# EAGLE design Keg Cop - Sensors (EAGLE 9.6.2)
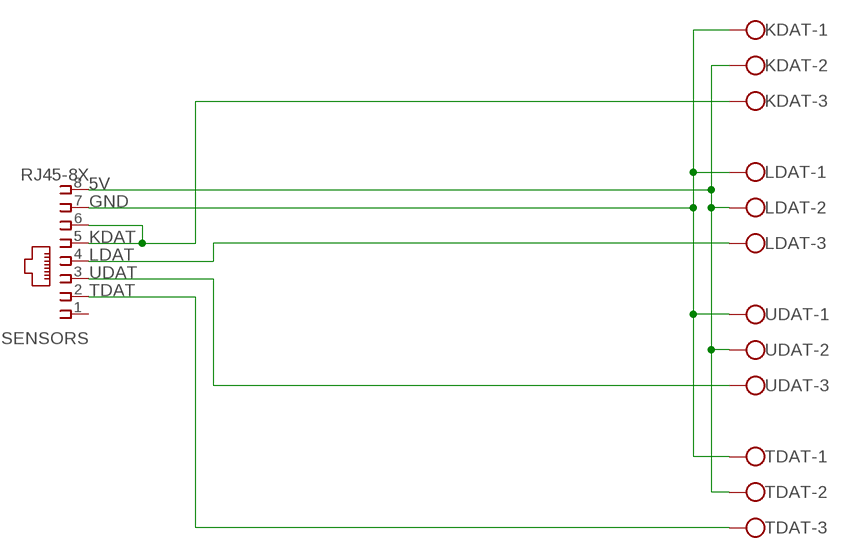
[diagram p0: schematic, sheet 1]

## Parts
KDAT  W237-103  [W237-103]
LDAT  W237-103  [W237-103]
SENSORS  RJ45-8X  [RJ45-NO-SHIELD]
TDAT  W237-103  [W237-103]
UDAT  W237-103  [W237-103]

## Nets
5V: KDAT.2 LDAT.2 SENSORS.8 TDAT.2 UDAT.2
GND: KDAT.1 LDAT.1 SENSORS.7 TDAT.1 UDAT.1
KDAT: KDAT.3 SENSORS.5 SENSORS.6
LDAT: LDAT.3 SENSORS.4
TDAT: SENSORS.2 TDAT.3
UDAT: SENSORS.3 UDAT.3
Unconnected: SENSORS.1

## Library data of the parts
KDAT LDAT TDAT UDAT = con-wago-500:W237-103: WAGO SCREW CLAMP; MPN: 237-103; OC_FARNELL: unknown; OC_NEWARK: 18M7116
SENSORS = con-tycoelectronics:RJ45: CORCOM Modular RJ Jacks No Shield Source: www.tycoelectronics.com .. ENG_DS_1654001_1099_RJ_L_0507.pdf; MPN: RJ45-8X; OC_FARNELL: unknown; OC_NEWARK: 16R6101

## Board
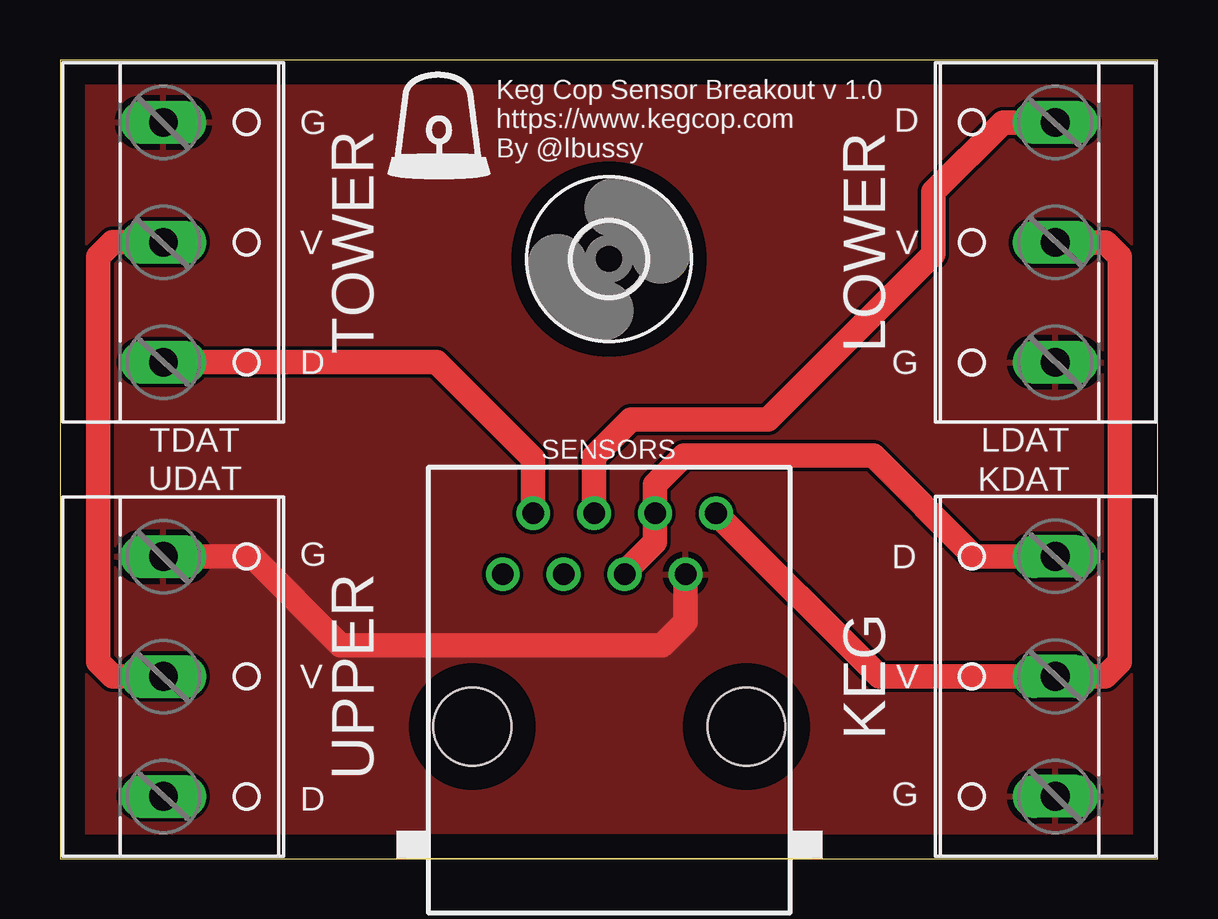
[diagram p1: board, top side]
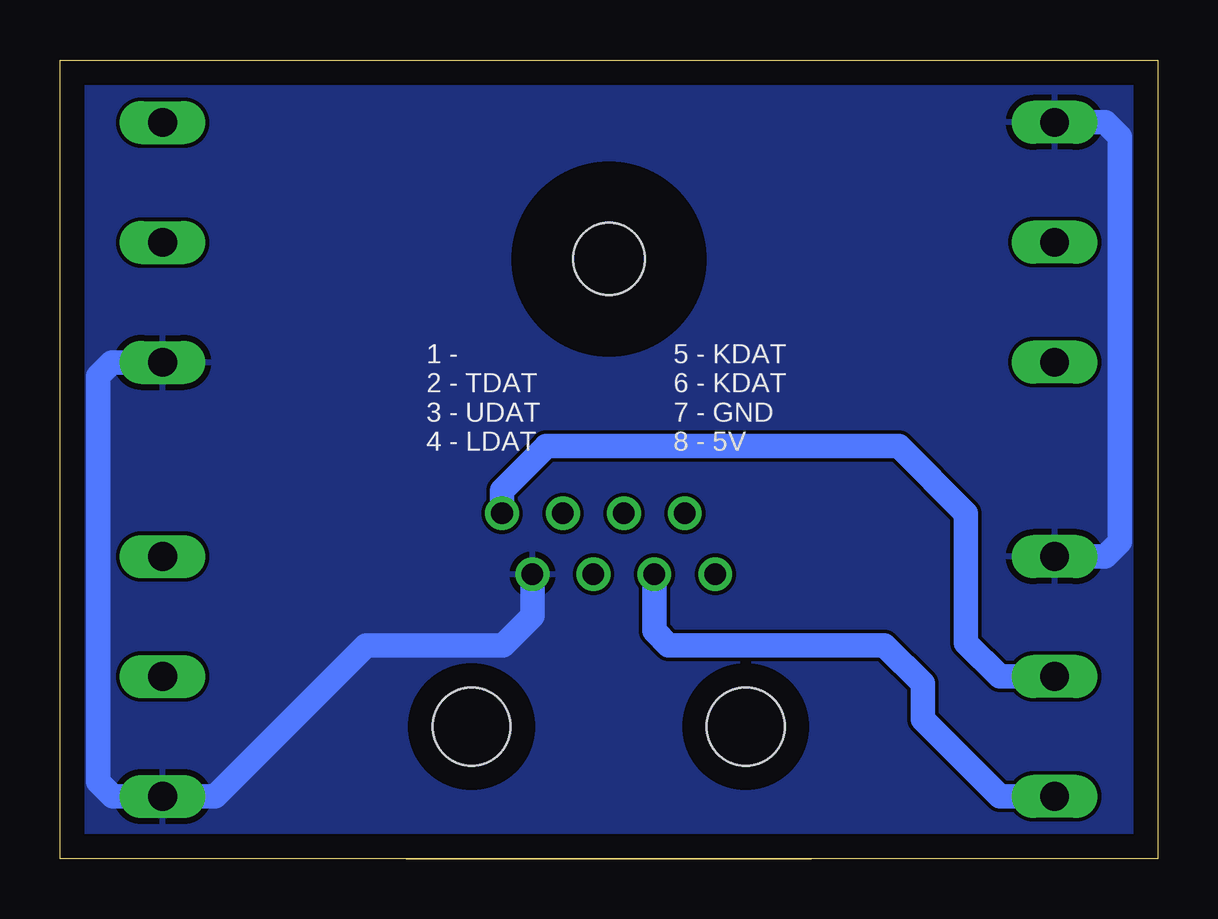
[diagram p2: board, bottom side, seen from below]

Size 45.77 x 33.3 mm. Coordinates in mm from the lower left corner, seen from the top.
Outline: 0,33.3 0,0 45.77,0 45.77,33.3 0,33.3
Copper layers (1*16): Top 0.035mm / dielectric 1.5mm / Bottom 0.035mm
Design rules "default": minimum track width 6mil, minimum drill 0.35mm, track to track 6mil, track to pad 6mil, pad to pad 6mil, via to via 6mil, smd to smd 6mil, copper to edge 40mil, drill to drill 6mil, minimum pad ring 10mil, minimum via ring 8mil, stop-mask expansion 4mil, vias tented up to drill 0mil, thermal gap 10mil

### Footprints (pad centres in the part's own frame; a part is rotated, then mirrored left to right if it is on the bottom)
W237-103 = drill 1.194 long: 1 -5,-1.29; 2 0,-1.29; 3 5,-1.29
RJ45-NO-SHIELD = drill 0.9 pad 1.4: 1 -4.445,6.35; 2 -3.175,8.89; 3 -1.905,6.35; 4 -0.635,8.89; 5 0.635,6.35; 6 1.905,8.89; 7 3.175,6.35; 8 4.445,8.89 | hole 3.251: -5.715,0; 5.715,0
3,0 = hole 3: 0,0

### Placement (x,y rotation side)
KDAT  40.2,7.6 90 top
LDAT  40.2,25.69 90 top
SENSORS  22.9,5.51 0 top
TDAT  5.6,25.7 270 top
U$1  [3,0]  22.88,25 0 top
UDAT  5.6,7.6 270 top

### Tracks (layer width: path | path; a pad name or v marks a point on that pad's centre or on a via)
5V
  Top 1.016: UDAT.2 2.2,7.6 1.6,8.2 1.6,25.1 2.2,25.7 TDAT.2 | SENSORS.8 34.15,7.6 KDAT.2 43.58,7.6 44.18,8.2 44.18,25.1 43.59,25.69 LDAT.2
  Bottom 0.152: 25.5,17.2 25.6,17.1
  Bottom 1.016: 25.6,17.1 27.34,15.36 SENSORS.8 | UDAT.2 6.6,7.6 8,9 8,14.4 10.8,17.2 25.5,17.2
GND
  Top 1.016: SENSORS.7 26.08,9.88 25.1,8.9 11.7,8.9 8,12.6 UDAT.1
  Bottom 1.016: SENSORS.7 26.08,10.13 27.3,8.9 33,8.9 39.3,2.6 KDAT.1 43.58,2.6 44.18,3.2 44.18,20.12 43.61,20.69 LDAT.1 | UDAT.1 2.2,12.6 1.6,13.2 1.6,30.1 2.2,30.7 TDAT.1
  pour Top: -0.2,33.5 46,33.5 46,-0.1 46.1,-0.2 -0.1,-0.2
  pour Bottom: 45.9,33.5 46,33.4 46,-0.2 0,-0.2 0,33.4 0.1,33.5
KDAT
  Top 1.016: SENSORS.5 23.53,11.94 24.8,13.21 SENSORS.6 24.8,15.61 26,16.8 33.9,16.8 38.1,12.6 KDAT.3
LDAT
  Top 1.016: SENSORS.4 22.27,16.77 23.8,18.3 29.5,18.3 36.4,25.2 36.4,27.8 39.29,30.69 LDAT.3
TDAT
  Top 1.016: SENSORS.2 19.73,16.68 15.7,20.7 TDAT.3
UDAT
  Bottom 1.016: SENSORS.3 20.99,9.5 20.4,8.9 11.4,8.9 9.8,7.3 9.8,5.8 6.6,2.6 UDAT.3

### Text on the board
tNames: G | D | Keg Cop Sensor Breakout v 1.0 / https://www.kegcop.com / By @lbussy | V | TOWER | LOWER | V | D | G | G | D | V | UPPER | KEG | V | G | D
bNames: 5 - KDAT / 6 - KDAT / 7 - GND / 8 - 5V | 1 - / 2 - TDAT / 3 - UDAT / 4 - LDAT